# Altium project Motor_Driver_Model_D201.PrjPcb
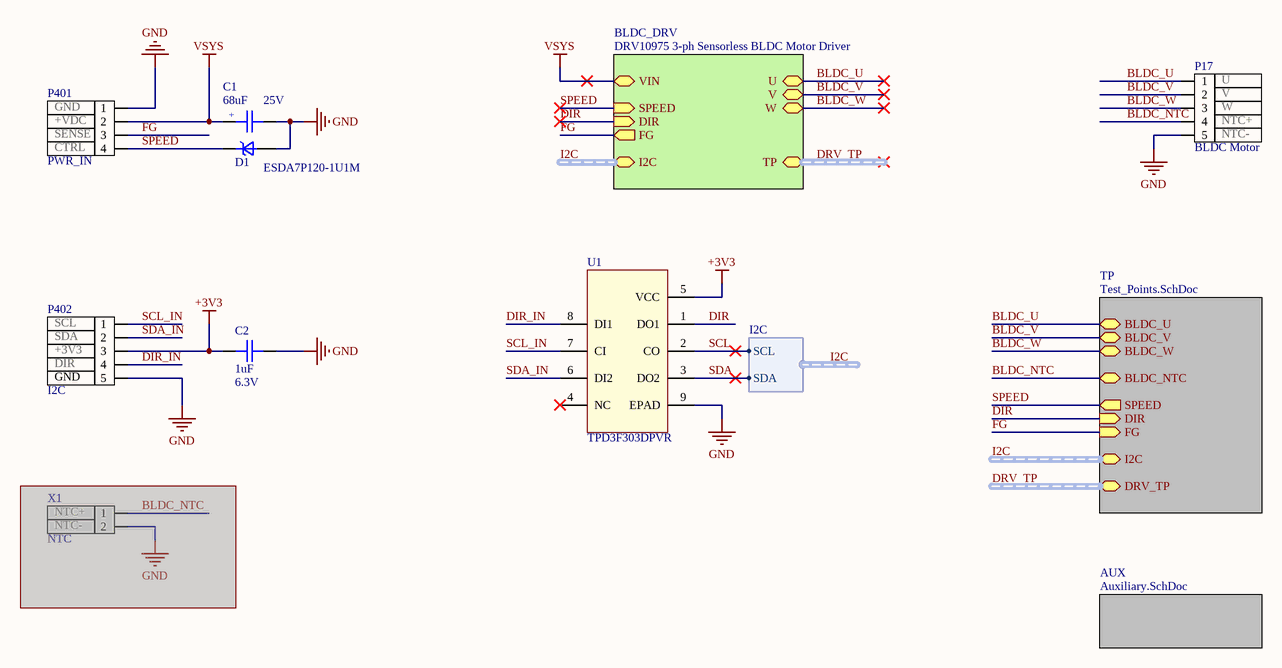
[diagram p0: Top_Motor_Driver_Model_D201.SchDoc]
_address1: 30 N Gould St suite 4000; _address2: Sheridan WY 82801; _BoardName: Motor_Driver; _CompanyName: Acme_CPU; _DateCode: 2020.30; _DocumentDate: 20201105; _HWEngineer: VSI; _PCBModel: D201; _PCBNumber: 001; _Revision: 0.1; _Title: Motor_Driver
3 sheets, 36 parts. Net scope: hierarchical (ports join the sheet entries above them; power ports are global).
Board file: Motor_Driver_Model_D201.PcbDoc
Sheets:
  Top_Motor_Driver_Model_D201.SchDoc
    TP = Test_Points.SchDoc
    AUX = Auxiliary.SchDoc

## Sheet Top_Motor_Driver_Model_D201.SchDoc: BLDC Motor Driver Block Diagram
size A4; DocumentNumber: 1; SheetNumber: 1; SheetTotal: 5

### Parts
C1  Capacitance: 68uF  Voltage Rating: 25V  [WCAP-ASLI_6.3x5.5]  (hidden comment: CAP ALUM 68 UF 20% 25 V SMD)
C2  Capacitance: 1uF  Voltage Rating: 6.3V  [C0402]  (hidden comment: CAP CER 1UF 6.3V X5R 0402)
D1  ESDA7P120-1U1M  [ST_QFN_1610]
P17  BLDC Motor  pin_1: U  pin_2: V  pin_3: W  pin_4: NTC+  pin_5: NTC-  [CONN_S5B-ZR(LF)(SN)]
P401  PWR_IN  pin_1: GND  pin_2: +VDC  pin_3: SENSE  pin_4: CTRL  [CONN_S4B-ZR(LF)(SN)]
P402  I2C  pin_1: SCL  pin_2: SDA  pin_3: +3V3  pin_4: DIR  pin_5: GND  [CONN_S5B-ZR(LF)(SN)]
U1  TPD3F303DPVR  [DPV8_1P7X0P4]
X1  NTC  pin_1: NTC+  pin_2: NTC-  [CONN_S2B-ZR_JST]  (masked out: inside a compile mask, not in the netlist)

### Sub-sheets
AUX = Auxiliary.SchDoc: no entries
BLDC_DRV = DRV10975 3-ph Sensorless BLDC Motor Driver (file not in this document): VIN, U, V, W, FG (out), SPEED (in), I2C (harness I2C), DIR (in), TP (harness DRV10975_TP)
TP = Test_Points.SchDoc: BLDC_U, BLDC_W, BLDC_V, I2C (harness I2C), BLDC_NTC, DRV_TP (harness DRV10975_TP), SPEED (out), DIR (in), FG (in)

### Harnesses
I2C: SCL, SDA

### Nets
+3V3: C2.2 P402.3 U1.5(VCC)
GND: C1.2 C2.1 D1.2(A) P17.5 P401.1 P402.5 U1.9(EPAD)
VSYS: C1.1 P401.2 ; sheet BLDC_DRV/VIN
BLDC_NTC: P17.4 ; sheet TP/BLDC_NTC
BLDC_U: P17.1 ; sheet TP/BLDC_U, sheet BLDC_DRV/U
BLDC_V: P17.2 ; sheet TP/BLDC_V, sheet BLDC_DRV/V
BLDC_W: P17.3 ; sheet TP/BLDC_W, sheet BLDC_DRV/W
DIR: U1.1(DO1) ; sheet TP/DIR, sheet BLDC_DRV/DIR
DIR_IN: P402.4 U1.8(DI1)
FG: P401.3 ; sheet TP/FG, sheet BLDC_DRV/FG
SCL: U1.2(CO) ; sheet TP/I2C.SCL  [project net I2C.SCL]
SCL_IN: P402.1 U1.7(CI)
SDA: U1.3(DO2) ; sheet TP/I2C.SDA  [project net I2C.SDA]
SDA_IN: P402.2 U1.6(DI2)
SPEED: D1.1(K) P401.4 ; sheet TP/SPEED, sheet BLDC_DRV/SPEED

Not connected (* = marked no-connect by the designer): U1 4(NC)*

### Buses and harness runs
harness DRV_TP = sheet BLDC_DRV/TP
harness DRV_TP = sheet TP/DRV_TP
harness I2C = sheet BLDC_DRV/I2C
harness I2C = sheet TP/I2C

### Notes on the sheet
- Title
- Size:
- Date:
- A4
- Number:
- Time:
- Revision:
- Sheet
- of
- File:
- (in symbol CAP ALUM 68 UF 20% 25 V SMD) +

### Library data of the parts
C1 = CAP ALUM 68 UF 20% 25 V SMD: WCAP-ASLI Aluminum Electrolytic Capacitor, V-Chip, SMT, D6.3xH5.5mm, 68uF, 25V; Manufacturer: Wurth Elektronik; Manufacturer Part Number: 865080443009; Life (Hours): 2000Hour; Dissipation Factor: 14%; Endurance: 2000h; Leakage Current: 17uA; Ripple Current: 240mA; Capacitance Tolerance: +/-20%; Rated Voltage: 25VDC; Technical Reference: ASED055680M025DVCTBB000; Polarity: Polar; Impedance: 480mR; Supplier 1: Digi-Key; Stock 1: 1129; Pricing 1: 1=0.26, 50=0.222, 100=0.194, 250=0.172, 500=0.151 (USD); Case/Package: Radial; Min Operating Temperature: -55°C; Max Operating Temperature: 105°C; Packaging: Tape and Reel; Tolerance: 20%; ComponentLink1URL: http://www.we-online.de; ComponentLink1Description: Manufacturer; Supplier Part Number 1: 732-8437-1-ND; Voltage Rating (DC): 25V; Diameter: 6.3mm; Height: 5.5mm; REACH SVHC: Unknown; ComponentLink2URL: https://www.we-online.com/catalog/datasheet/865080443009.pdf; ComponentLink2Description: Datasheet; ComponentLink3URL: http://www.farnell.com/datasheets/1880144.pdf?src-supplier=Farnell; ComponentLink3Description: http://www.farnell.com/datasheets/1880144.pdf?src-supplier=Farnell; Mounting Technology: SMT; Operating Temperature: -55 to +105degC; Published Date: May 2020; Mount: Surface Mount; Package Quantity: 1000; Ripple Current (AC): 240mA; Height - Seated (Max): 0.217inch; ComponentLink4URL: http://katalog.we-online.de/pbs/datasheet/865080443009.pdf?src-supplier=Digi-Key; ComponentLink4Description: http://katalog.we-online.de/pbs/datasheet/865080443009.pdf?src-supplier=Digi-Key; ComponentLink5URL: https://katalog.we-online.de/pbs/datasheet/865080443009.pdf?src-supplier=Digi-Key; ComponentLink5Description: https://katalog.we-online.de/pbs/datasheet/865080443009.pdf?src-supplier=Digi-Key; ComponentLink6URL: http://www.farnell.com/datasheets/1880144.pdf?src-supplier=Element14; ComponentLink6Description: http://www.farnell.com/datasheets/1880144.pdf?src-supplier=Element14
C2 = CAP CER 1UF 6.3V X5R 0402: 1µF ±10% 6.3V Ceramic Capacitor X5R 0402 (1005 Metric); Manufacturer: Yageo; Manufacturer Part Number: CC0402KRX5R5BB105; Supplier 1: Digi-Key; Stock 1: 34926286; Pricing 1: 1=0.1, 10=0.05, 50=0.0272, 100=0.0222, 500=0.0158, 1000=0.0124, 2500=0.0113, 5000=0.0104 (USD); Mount: Surface Mount; Number of Pins: 2; Case Code (Imperial): 0402; Case Code (Metric): 1005; Min Operating Temperature: -55°C; Max Operating Temperature: 85°C; Tolerance: 10%; Packaging: Tape and Reel; Termination: SMD/SMT; Voltage Rating (DC): 6.3V; Composition: Ceramic; Length: 1mm; Height: 0.5mm; Width: 0.02inch; Thickness: 0.022inch; Depth: 0.5mm; Radiation Hardening: No; Lead Free: Lead Free; Halogen Free: Halogen Free; ComponentLink1URL: http://www.farnell.com/datasheets/70765.pdf?src-supplier=Farnell; ComponentLink1Description: http://www.farnell.com/datasheets/70765.pdf?src-supplier=Farnell; Supplier Part Number 1: 311-1438-1-ND; Dielectric: X5R; Case/Package: 0402; Dielectric Material: Ceramic; Package Quantity: 1; REACH SVHC: No SVHC; ComponentLink2URL: http://www.yageo.com/documents/recent/UPY-GPHC_X5R_4V-to-50V_25.pdf?src-supplier=Digi-Key; ComponentLink2Description: http://www.yageo.com/documents/recent/UPY-GPHC_X5R_4V-to-50V_25.pdf?src-supplier=Digi-Key; ComponentLink3URL: http://www.farnell.com/datasheets/2167237.pdf?src-supplier=Element14; ComponentLink3Description: http://www.farnell.com/datasheets/2167237.pdf?src-supplier=Element14; ComponentLink4URL: http://www.yageo.com/documents/recent/UPY-GPHC_X5R_4V-to-50V_12.pdf?src-supplier=Avnet+Europe; ComponentLink4Description: http://www.yageo.com/documents/recent/UPY-GPHC_X5R_4V-to-50V_12.pdf?src-supplier=Avnet+Europe; ComponentLink5URL: http://www.farnell.com/datasheets/1359354.pdf?src-supplier=Element14; ComponentLink5Description: http://www.farnell.com/datasheets/1359354.pdf?src-supplier=Element14; ComponentLink6URL: http://www.farnell.com/datasheets/70765.pdf?src-supplier=Element14; ComponentLink6Description: http://www.farnell.com/datasheets/70765.pdf?src-supplier=Element14; ComponentLink7URL: http://www.yageo.com/documents/recent/UPY-GPHC_X5R_4V-to-50V_12.pdf?src-supplier=Avnet; ComponentLink7Description: http://www.yageo.com/documents/recent/UPY-GPHC_X5R_4V-to-50V_12.pdf?src-supplier=Avnet
D1 = TVS DIODE ESDA7P120-1U1M 5.5V 11.5V 1610: 11.5V Clamp 120A (8/20µs) Ipp Tvs Diode Surface Mount 1610; Manufacturer: STMicroelectronics; Number of Unidirectional Channels: 1; Reverse Standoff Voltage: 5.5V; Min Breakdown Voltage: 6.4V; Peak Pulse Power: 1.4kW; Power Line Protection: No; Supplier 1: Digi-Key; Manufacturer Part Number: ESDA7P120-1U1M; Stock 1: 15775; Pricing 1: 1=0.35, 10=0.287, 25=0.2624, 100=0.1647, 250=0.1629, 500=0.1525, 1000=0.1037, 2500=0.0994 (USD); Mount: Surface Mount; Case/Package: 0603; Case Code (Imperial): 0603; Case Code (Metric): 1610; Min Operating Temperature: -55°C; Max Operating Temperature: 150°C; Composition: Zener; Packaging: Cut Tape; Clamping Voltage: 11.5V; Peak Pulse Current: 120A; ComponentLink1URL: http://www.st.com/content/ccc/resource/technical/document/datasheet/group3/5e/7c/5d/76/3f/de/45/35/DM00359316/files/DM00359316.pdf/jcr:content/translations/en.DM00359316.pdf?src-supplier=Digi-Key; ComponentLink1Description: http://www.st.com/content/ccc/resource/technical/document/datasheet/group3/5e/7c/5d/76/3f/de/45/35/DM00359316/files/DM00359316.pdf/jcr:content/translations/en.DM00359316.pdf?src-supplier=Digi-Key; ComponentLink2URL: http://www.farnell.com/datasheets/2815837.pdf?src-supplier=Newark; ComponentLink2Description: http://www.farnell.com/datasheets/2815837.pdf?src-supplier=Newark; ComponentLink3URL: http://www.farnell.com/datasheets/2815837.pdf?src-supplier=Farnell; ComponentLink3Description: http://www.farnell.com/datasheets/2815837.pdf?src-supplier=Farnell; ComponentLink4URL: http://www.farnell.com/datasheets/2815837.pdf?src-supplier=Element14; ComponentLink4Description: http://www.farnell.com/datasheets/2815837.pdf?src-supplier=Element14; Supplier Part Number 1: 497-17159-1-ND
P17 = CONN HEADER TH R/A 5POS 1.5MM: Connector Header Through Hole, Right Angle 5 position 0.059" (1.50mm); Manufacturer: JST; Manufacturer Part Number: S5B-ZR(LF)(SN); Number of Positions: 5; Gender: Male; Connector Type: Male Pin; Current Rating: 1A; Voltage Rating: 50V; Contact Resistance: 30mR; Pitch: 1.5mm; Supplier 1: Digi-Key; Stock 1: 41138; Pricing 1: 1=0.29, 10=0.272, 100=0.1889, 500=0.1598, 1000=0.1308, 5000=0.1162, 10000=0.1053 (USD); Mount: Through Hole; Number of Pins: 5; Contact Material: Brass,Tin; Color: Natural; Contact Plating: Tin,Copper; Housing Color: Beige; Housing Material: Polyamide; Min Operating Temperature: -25°C; Max Operating Temperature: 85°C; Termination: Press-Fit; Number of Rows: 1; Packaging: Bulk; Fastening Type: Detent; Number of Contacts: 5; Orientation: Right Angle; Max Current Rating: 1A; Max Voltage Rating (AC): 50V; Length: 9mm; Height: 7.2mm; Width: 3.5mm; Contact Mating Length: 0.094inch; Depth: 6mm; Lead Free: Lead Free; ComponentLink1URL: http://www.jst-mfg.com/product/pdf/eng/eZH.pdf?src-supplier=Digi-Key; ComponentLink1Description: http://www.jst-mfg.com/product/pdf/eng/eZH.pdf?src-supplier=Digi-Key; ComponentLink2URL: https://www.verical.com/server-webapp/html/getDatasheet?partID=640593&src-supplier=Verical; ComponentLink2Description: https://www.verical.com/server-webapp/html/getDatasheet?partID=640593&src-supplier=Verical; ComponentLink3URL: http://www1.futureelectronics.com/doc/JST/S5B-ZR(LF)(SN).pdf?src-supplier=Future+Electronics; ComponentLink3Description: http://www1.futureelectronics.com/doc/JST/S5B-ZR(LF)(SN).pdf?src-supplier=Future+Electronics; ComponentLink4URL: http://www.produktinfo.conrad.com/datenblaetter/725000-749999/741204-da-01-en-STIFTLEISTE_GEWINKELT_5_POL_RM1_5.pdf?src-supplier=Conrad; ComponentLink4Description: http://www.produktinfo.conrad.com/datenblaetter/725000-749999/741204-da-01-en-STIFTLEISTE_GEWINKELT_5_POL_RM1_5.pdf?src-supplier=Conrad; Supplier Part Number 1: 455-1672-ND
P401 = CONN HEADER TH R/A 4POS 1.5MM: Connector Header Through Hole, Right Angle 4 position 0.059" (1.50mm); Manufacturer: JST; Manufacturer Part Number: S4B-ZR(LF)(SN); Body Plating: Tin; Number of Positions: 4; Connector Type: Header,Male Pin; Voltage Rating: 50V; Contact Resistance: 30mR; Max Current Rating: 1A; Insulation Resistance: 500MR; Gender: Male; Pitch: 1.5mm; Panel Thickness: 3.5mm; Supplier 1: Arrow; Stock 1: 0; Mount: Through Hole; Number of Pins: 4; Color: White; Contact Plating: Tin,Copper; Contact Material: Brass,Tin,Copper; Material: Nylon; Housing Color: Beige; Housing Material: Polyamide; Contact Shape: Circular; Insulation Material: Nylon; Insulation Color: Natural; Min Operating Temperature: -25°C; Max Operating Temperature: 85°C; Packaging: Bulk; Number of Rows: 1; Termination: Solder; Voltage Rating (DC): 50V; Current Rating: 1A; Voltage Rating (AC): 50V; Fastening Type: Detent; Max Voltage Rating (AC): 50V; Max Voltage Rating (DC): 50V; Number of Contacts: 4; Orientation: Right Angle; Length: 7.5mm; Height: 7.2mm; Width: 3.5mm; Depth: 6mm; Lead Pitch: 1.5mm; Contact Mating Length: 0.094inch; REACH SVHC: No SVHC; Lead Free: Lead Free; Flammability Rating: UL94 V-0; ComponentLink1URL: https://www.verical.com/server-webapp/html/getDatasheet?partID=763273&src-supplier=Verical; ComponentLink1Description: https://www.verical.com/server-webapp/html/getDatasheet?partID=763273&src-supplier=Verical; ComponentLink2URL: https://www.verical.com/server-webapp/html/getDatasheet?partID=640380&src-supplier=Verical; ComponentLink2Description: https://www.verical.com/server-webapp/html/getDatasheet?partID=640380&src-supplier=Verical; ComponentLink3URL: http://www1.futureelectronics.com/doc/JST/S4B-ZR(LF)(SN).pdf?src-supplier=Future+Electronics; ComponentLink3Description: http://www1.futureelectronics.com/doc/JST/S4B-ZR(LF)(SN).pdf?src-supplier=Future+Electronics; ComponentLink4URL: http://www.jst-mfg.com/product/pdf/eng/eZH.pdf?src-supplier=Digi-Key; ComponentLink4Description: http://www.jst-mfg.com/product/pdf/eng/eZH.pdf?src-supplier=Digi-Key; ComponentLink5URL: http://www.farnell.com/datasheets/80556.pdf?src-supplier=Element14; ComponentLink5Description: http://www.farnell.com/datasheets/80556.pdf?src-supplier=Element14; ComponentLink6URL: https://www.verical.com/server-webapp/html/getDatasheet?partID=703398&src-supplier=Verical; ComponentLink6Description: https://www.verical.com/server-webapp/html/getDatasheet?partID=703398&src-supplier=Verical; Supplier Part Number 1: S4B-ZR(LF)(SN)
P402 = CONN HEADER TH R/A 5POS 1.5MM: Connector Header Through Hole, Right Angle 5 position 0.059" (1.50mm); Manufacturer: JST; Manufacturer Part Number: S5B-ZR(LF)(SN); Number of Positions: 5; Gender: Male; Pitch: 1.5mm; Connector Type: Male Pin; Current Rating: 1A; Voltage Rating: 50V; Contact Resistance: 30mR; Supplier 1: Digi-Key; Stock 1: 41138; Pricing 1: 1=0.29, 10=0.272, 100=0.1889, 500=0.1598, 1000=0.1308, 5000=0.1162, 10000=0.1053 (USD); Mount: Through Hole; Housing Material: Polyamide; Contact Plating: Tin,Copper; Color: Natural; Min Operating Temperature: -25°C; Max Operating Temperature: 85°C; Number of Rows: 1; Packaging: Bulk; Termination: Press-Fit; Orientation: Right Angle; Number of Contacts: 5; ComponentLink1URL: http://www.jst-mfg.com/product/pdf/eng/eZH.pdf?src-supplier=Digi-Key; ComponentLink1Description: http://www.jst-mfg.com/product/pdf/eng/eZH.pdf?src-supplier=Digi-Key; Supplier Part Number 1: 455-1672-ND; Housing Color: Beige; Fastening Type: Detent; Length: 9mm; Depth: 6mm; Contact Mating Length: 0.094inch; Number of Pins: 5; Contact Material: Brass,Tin; Max Current Rating: 1A; Max Voltage Rating (AC): 50V; Height: 7.2mm; Width: 3.5mm; Lead Free: Lead Free; ComponentLink2URL: https://www.verical.com/server-webapp/html/getDatasheet?partID=640593&src-supplier=Verical; ComponentLink2Description: https://www.verical.com/server-webapp/html/getDatasheet?partID=640593&src-supplier=Verical; ComponentLink3URL: http://www1.futureelectronics.com/doc/JST/S5B-ZR(LF)(SN).pdf?src-supplier=Future+Electronics; ComponentLink3Description: http://www1.futureelectronics.com/doc/JST/S5B-ZR(LF)(SN).pdf?src-supplier=Future+Electronics; ComponentLink4URL: http://www.produktinfo.conrad.com/datenblaetter/725000-749999/741204-da-01-en-STIFTLEISTE_GEWINKELT_5_POL_RM1_5.pdf?src-supplier=Conrad; ComponentLink4Description: http://www.produktinfo.conrad.com/datenblaetter/725000-749999/741204-da-01-en-STIFTLEISTE_GEWINKELT_5_POL_RM1_5.pdf?src-supplier=Conrad
U1 = FILTER RC(PI) ESD SMD  8-UFDFN EP: RC (Pi) EMI Filter 2nd Order Low Pass 3 Channel R = 47Ohms, 100Ohms, C = 20pF  8-UFDFN Exposed Pad; Manufacturer: Texas Instruments; Number of Channels: 3; Frequency: 308MHz; ESD Protection: Yes; Operating Supply Voltage: 5.5V; Clamping Voltage: 10V; Supplier 1: Digi-Key; Manufacturer Part Number: TPD3F303DPVR; Stock 1: 4896; Pricing 1: 1=0.85, 10=0.812, 25=0.7856, 50=0.6414, 100=0.576, 250=0.5236, 500=0.4974, 1000=0.4451 (USD); Case/Package: SMD/SMT; Min Operating Temperature: -40°C; Max Operating Temperature: 85°C; Packaging: Tape and Reel; ComponentLink1URL: http://www.ti.com/lit/ds/symlink/tpd3f303.pdf?src-supplier=Digi-Key; ComponentLink1Description: http://www.ti.com/lit/ds/symlink/tpd3f303.pdf?src-supplier=Digi-Key; ComponentLink2URL: http://focus.ti.com/lit/ds/symlink/tpd3f303.pdf?src-supplier=Avnet+Europe; ComponentLink2Description: http://focus.ti.com/lit/ds/symlink/tpd3f303.pdf?src-supplier=Avnet+Europe; ComponentLink3URL: https://www.verical.com/server-webapp/html/getDatasheet?partID=302817&src-supplier=Verical; ComponentLink3Description: https://www.verical.com/server-webapp/html/getDatasheet?partID=302817&src-supplier=Verical; ComponentLink4URL: http://www.farnell.com/datasheets/1558442.pdf?src-supplier=Element14; ComponentLink4Description: http://www.farnell.com/datasheets/1558442.pdf?src-supplier=Element14; Supplier Part Number 1: 296-28299-1-ND; Number of Pins: 8; Contact Plating: Gold; Package Quantity: 1; Capacitance: 20pF; Termination: Flat; Length: 2.2mm; Height: 0.026inch; Width: 0.063inch; Depth: 1.7mm; Radiation Hardening: No; Lead Free: Lead Free; REACH SVHC: No SVHC; Mount: Surface Mount
X1 = CONN HEADER TH R/A 2POS 1.5MM: Connector Header Through Hole, Right Angle 2 position 0.059" (1.50mm); Manufacturer: JST; Manufacturer Part Number: S2B-ZR(LF)(SN); Body Plating: Tin; Number of Positions: 2; Gender: Male; Connector Type: Male Pin; Current Rating: 1A; Contact Resistance: 30mR; Voltage Rating: 50V; Insulation Resistance: 500MR; Pitch: 1.5mm; Panel Thickness: 3.5mm; Supplier 1: Digi-Key; Stock 1: 14685; Pricing 1: 1=0.19, 10=0.177, 100=0.109, 500=0.0902, 1000=0.079, 5000=0.0677, 10000=0.0658 (USD); Mount: Through Hole; Number of Pins: 2; Contact Plating: Tin,Copper; Contact Material: Brass,Tin,Copper; Color: Natural,White; Housing Color: Beige; Housing Material: Polyamide; Material: Nylon; Min Operating Temperature: -25°C; Max Operating Temperature: 85°C; Termination: Press-Fit; Number of Rows: 1; Packaging: Bulk; Fastening Type: Detent; Number of Contacts: 2; Orientation: Right Angle; Voltage Rating (AC): 50V; Voltage Rating (DC): 50V; Max Current Rating: 1A; Max Voltage Rating (AC): 50V; Length: 4.5mm; Height: 7.2mm; Width: 3.5mm; Contact Mating Length: 0.094inch; Depth: 6mm; Lead Pitch: 1.5mm; Lead Free: Lead Free; Flammability Rating: UL94 V-0; REACH SVHC: No SVHC; ComponentLink1URL: http://www.farnell.com/datasheets/80556.pdf?src-supplier=Element14; ComponentLink1Description: http://www.farnell.com/datasheets/80556.pdf?src-supplier=Element14; ComponentLink2URL: http://www1.futureelectronics.com/doc/JST/S2B-ZR(LF)(SN).pdf?src-supplier=Future+Electronics; ComponentLink2Description: http://www1.futureelectronics.com/doc/JST/S2B-ZR(LF)(SN).pdf?src-supplier=Future+Electronics; ComponentLink3URL: http://www.jst-mfg.com/product/pdf/eng/eZH.pdf?src-supplier=Digi-Key; ComponentLink3Description: http://www.jst-mfg.com/product/pdf/eng/eZH.pdf?src-supplier=Digi-Key; ComponentLink4URL: https://www.verical.com/server-webapp/html/getDatasheet?partID=687340&src-supplier=Verical; ComponentLink4Description: https://www.verical.com/server-webapp/html/getDatasheet?partID=687340&src-supplier=Verical; Supplier Part Number 1: 455-1669-ND

## Sheet Test_Points.SchDoc: Test Points
size A4; DocumentNumber: 2; SheetNumber: 2; SheetTotal: 5
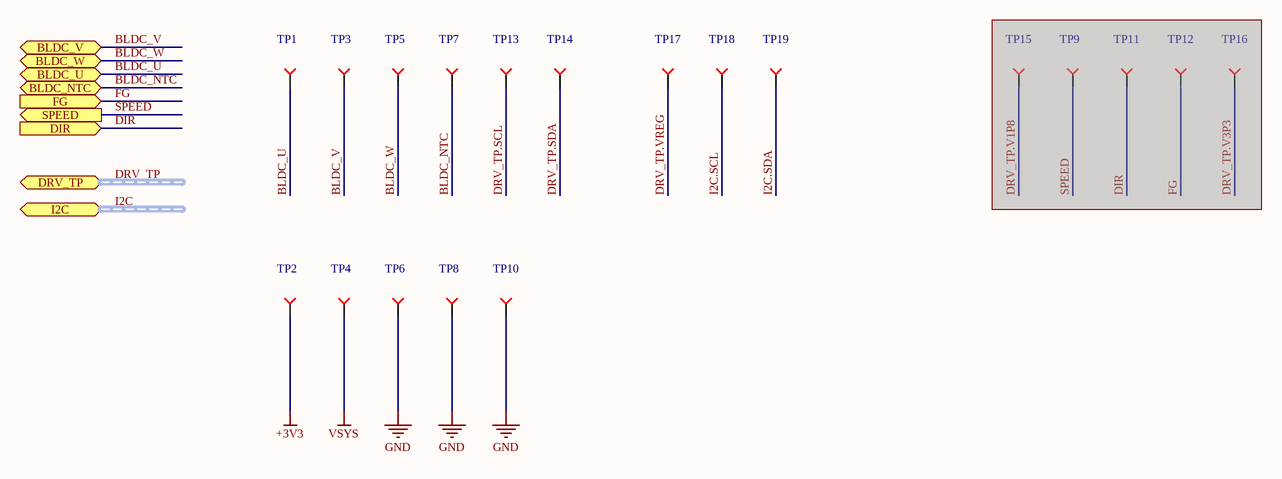
[diagram p1: Test_Points.SchDoc]

### Parts
TP1  Test Point Pad  [Testpoint]  (value not drawn)  (no BOM)
TP2  Test Point Pad  [Testpoint]  (value not drawn)  (no BOM)
TP3  Test Point Pad  [Testpoint]  (value not drawn)  (no BOM)
TP4  Test Point Pad  [Testpoint]  (value not drawn)  (no BOM)
TP5  Test Point Pad  [Testpoint]  (value not drawn)  (no BOM)
TP6  Test Point Pad  [Testpoint]  (value not drawn)  (no BOM)
TP7  Test Point Pad  [Testpoint]  (value not drawn)  (no BOM)
TP8  Test Point Pad  [Testpoint]  (value not drawn)  (no BOM)
TP9  Test Point Pad  [Testpoint]  (value not drawn)  (no BOM)  (masked out: inside a compile mask, not in the netlist)
TP10  Test Point Pad  [Testpoint]  (value not drawn)  (no BOM)
TP11  Test Point Pad  [Testpoint]  (value not drawn)  (no BOM)  (masked out: inside a compile mask, not in the netlist)
TP12  Test Point Pad  [Testpoint]  (value not drawn)  (no BOM)  (masked out: inside a compile mask, not in the netlist)
TP13  Test Point Pad  [Testpoint]  (value not drawn)  (no BOM)
TP14  Test Point Pad  [Testpoint]  (value not drawn)  (no BOM)
TP15  Test Point Pad  [Testpoint]  (value not drawn)  (no BOM)  (masked out: inside a compile mask, not in the netlist)
TP16  Test Point Pad  [Testpoint]  (value not drawn)  (no BOM)  (masked out: inside a compile mask, not in the netlist)
TP17  Test Point Pad  [Testpoint]  (value not drawn)  (no BOM)
TP18  Test Point Pad  [Testpoint]  (value not drawn)  (no BOM)
TP19  Test Point Pad  [Testpoint]  (value not drawn)  (no BOM)

### Ports
BLDC_NTC, BLDC_U, BLDC_V, BLDC_W, DIR (in), DRV_TP (harness DRV10975_TP), FG (in), I2C (harness I2C), SPEED (out)

### Nets
+3V3: TP2.1
GND: TP6.1 TP8.1 TP10.1
VSYS: TP4.1
BLDC_NTC: TP7.1 ; port BLDC_NTC
BLDC_U: TP1.1 ; port BLDC_U
BLDC_V: TP3.1 ; port BLDC_V
BLDC_W: TP5.1 ; port BLDC_W
DRV_TP.SCL: TP13.1
DRV_TP.SDA: TP14.1
DRV_TP.VREG: TP17.1
I2C.SCL: TP18.1
I2C.SDA: TP19.1

### Buses and harness runs
harness DRV_TP = port DRV_TP
harness I2C = port I2C

### Notes on the sheet
- Title
- Size:
- Date:
- A4
- Number:
- Time:
- Revision:
- Sheet
- of
- File:

### Library data of the parts
TP1-TP19 = Test Point Pad: Test Point. There is nothing to buy or mount.; ClassName: TestPoint; CompType: TestPoint; Manufacturer: N/A; MountType: N/A; PackageReference: TetsPoint; PartNumber: N/A

## Sheet Auxiliary.SchDoc: Auxiliary Components
size A4; DocumentNumber: 3; SheetNumber: 3; SheetTotal: 5
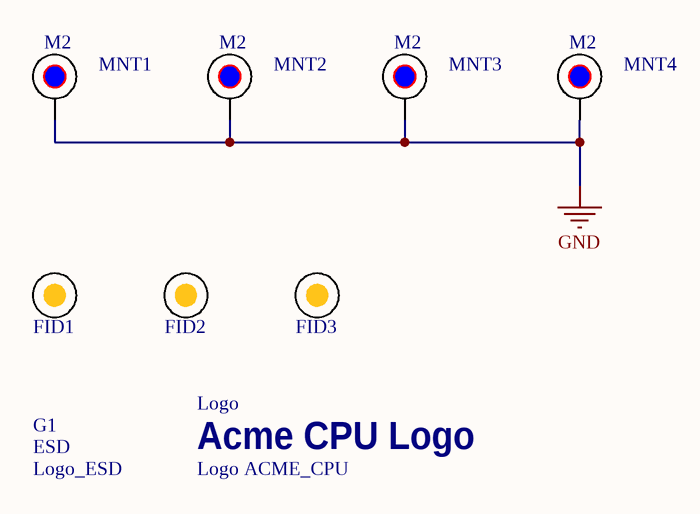
[diagram p2: Auxiliary.SchDoc]

### Parts
FID1  N/A  [Fiducial]  (value not drawn)  (no BOM)
FID2  N/A  [Fiducial]  (value not drawn)  (no BOM)
FID3  N/A  [Fiducial]  (value not drawn)  (no BOM)
G1  Logo_ESD  [Logo_ESD]  (no BOM)
Logo  Logo ACME_CPU  [LOGO_ACME_CPU]  (no BOM)
MNT1  MountHole M2. Nothing to buy or mount  [MountHole_M2]  (value not drawn)  (no BOM)
MNT2  MountHole M2. Nothing to buy or mount  [MountHole_M2]  (value not drawn)  (no BOM)
MNT3  MountHole M2. Nothing to buy or mount  [MountHole_M2]  (value not drawn)  (no BOM)
MNT4  MountHole M2. Nothing to buy or mount  [MountHole_M2]  (value not drawn)  (no BOM)

### Nets
GND: MNT1.1 MNT2.1 MNT3.1 MNT4.1

### Notes on the sheet
- Title
- Size:
- Date:
- A4
- Number:
- Time:
- Revision:
- Sheet
- of
- File:
- (in symbol Logo ACME_CPU) Acme CPU Logo
- (in symbol Logo_ESD) ESD
- (in symbol MountHole_M2) M2

### Library data of the parts
FID1-FID3 = Fiducial: Fiducial mark.  There is nothing to buy or mount.; CompType: Fiducial; Manufacturer: N/A; MountType: N/A; PackageReference: Fiducial; Manufacturer Part Number: N/A; ClassName: PCB_FEATURE
MNT1-MNT4 = MountHole_M2: PCB Mount Hole. There is nothing to buy or mount.
G1 = Logo_ESD: ClassName: PCB_FEATURE
Logo = Logo ACME_CPU: ClassName: PCB_FEATURE

## Nets that join several sheets
+3V3: Top_Motor_Driver_Model_D201 (C2.2 P402.3 U1.5), Test_Points (TP2.1)
GND: Top_Motor_Driver_Model_D201 (7 pins), Test_Points (TP6.1 TP8.1 TP10.1), Auxiliary (MNT1.1 MNT2.1 MNT3.1 MNT4.1)
VSYS: Top_Motor_Driver_Model_D201 (C1.1 P401.2), Test_Points (TP4.1)
BLDC_NTC: Top_Motor_Driver_Model_D201 (P17.4), Test_Points (TP7.1)
BLDC_U: Top_Motor_Driver_Model_D201 (P17.1), Test_Points (TP1.1)
BLDC_V: Top_Motor_Driver_Model_D201 (P17.2), Test_Points (TP3.1)
BLDC_W: Top_Motor_Driver_Model_D201 (P17.3), Test_Points (TP5.1)